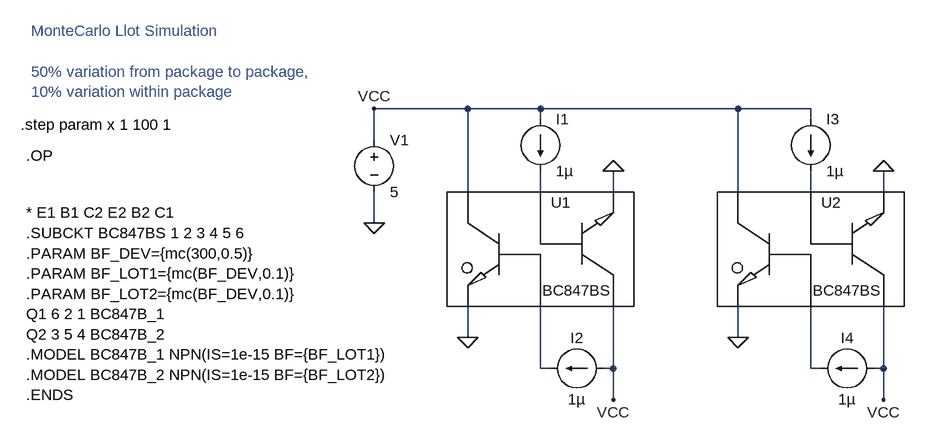
[diagram p0: schematic MonteCarlo_lot.asc]
MonteCarlo_lot.asc, the LTspice schematic file:
Version 4
SHEET 1 1896 680
WIRE 720 -48 576 -48
WIRE 832 -48 720 -48
WIRE 1136 -48 832 -48
WIRE 1248 -48 1136 -48
WIRE 832 -32 832 -48
WIRE 1248 -32 1248 -48
WIRE 576 0 576 -48
WIRE 720 80 720 -48
WIRE 832 80 832 48
WIRE 944 80 944 48
WIRE 1136 80 1136 -48
WIRE 1248 80 1248 48
WIRE 1360 80 1360 48
WIRE 576 128 576 80
WIRE 720 304 720 256
WIRE 1136 304 1136 256
WIRE 832 352 832 256
WIRE 848 352 832 352
WIRE 944 352 944 256
WIRE 944 352 928 352
WIRE 1248 352 1248 256
WIRE 1264 352 1248 352
WIRE 1360 352 1360 256
WIRE 1360 352 1344 352
WIRE 944 400 944 352
WIRE 1360 400 1360 352
FLAG 720 304 0
FLAG 576 128 0
FLAG 944 400 VCC
FLAG 944 48 0
FLAG 1136 304 0
FLAG 1360 400 VCC
FLAG 1360 48 0
FLAG 576 -48 VCC
SYMBOL current 832 -32 R0
SYMATTR InstName I1
SYMATTR Value 1µ
SYMBOL current 928 352 M270
WINDOW 0 32 40 VTop 0
WINDOW 3 -32 40 VBottom 0
SYMATTR InstName I2
SYMATTR Value 1µ
SYMBOL voltage 576 -16 R0
SYMATTR InstName V1
SYMATTR Value 5
SYMBOL BC847BS 800 144 R0
SYMATTR InstName U1
SYMBOL current 1248 -32 R0
SYMATTR InstName I3
SYMATTR Value 1µ
SYMBOL current 1344 352 M270
WINDOW 0 32 40 VTop 0
WINDOW 3 -32 40 VBottom 0
SYMATTR InstName I4
SYMATTR Value 1µ
SYMBOL BC847BS 1216 144 R0
SYMATTR InstName U2
TEXT 40 112 Left 0 !* E1 B1 C2 E2 B2 C1\n.SUBCKT BC847BS 1 2 3 4 5 6\n.PARAM BF_DEV={mc(300,0.5)}\n.PARAM BF_LOT1={mc(BF_DEV,0.1)}\n.PARAM BF_LOT2={mc(BF_DEV,0.1)}\nQ1 6 2 1 BC847B_1 \nQ2 3 5 4 BC847B_2\n.MODEL BC847B_1 NPN(IS=1e-15 BF={BF_LOT1})\n.MODEL BC847B_2 NPN(IS=1e-15 BF={BF_LOT2})\n.ENDS
TEXT 32 -24 Left 0 !.step param x 1 100 1
TEXT 40 24 Left 0 !.OP
TEXT 48 -168 Left 0 ;MonteCarlo Llot Simulation\n \n50% variation from package to package,\n10% variation within package

The netlist it stands for:
* MonteCarlo_lot.asc
I1 VCC N001 1µ
I2 VCC N003 1µ
V1 VCC 0 5
XU1 0 N003 VCC 0 N001 VCC BC847BS  ; pins E1 B1 C2 E2 B2 C1
I3 VCC N002 1µ
I4 VCC N004 1µ
XU2 0 N004 VCC 0 N002 VCC BC847BS  ; pins E1 B1 C2 E2 B2 C1
* E1 B1 C2 E2 B2 C1
.SUBCKT BC847BS 1 2 3 4 5 6
.PARAM BF_DEV={mc(300,0.5)}
.PARAM BF_LOT1={mc(BF_DEV,0.1)}
.PARAM BF_LOT2={mc(BF_DEV,0.1)}
Q1 6 2 1 BC847B_1
Q2 3 5 4 BC847B_2
.MODEL BC847B_1 NPN(IS=1e-15 BF={BF_LOT1})
.MODEL BC847B_2 NPN(IS=1e-15 BF={BF_LOT2})
.ENDS
.step param x 1 100 1
.OP
* MonteCarlo Llot Simulation
* 50% variation from package to package,
* 10% variation within package
.backanno
.end